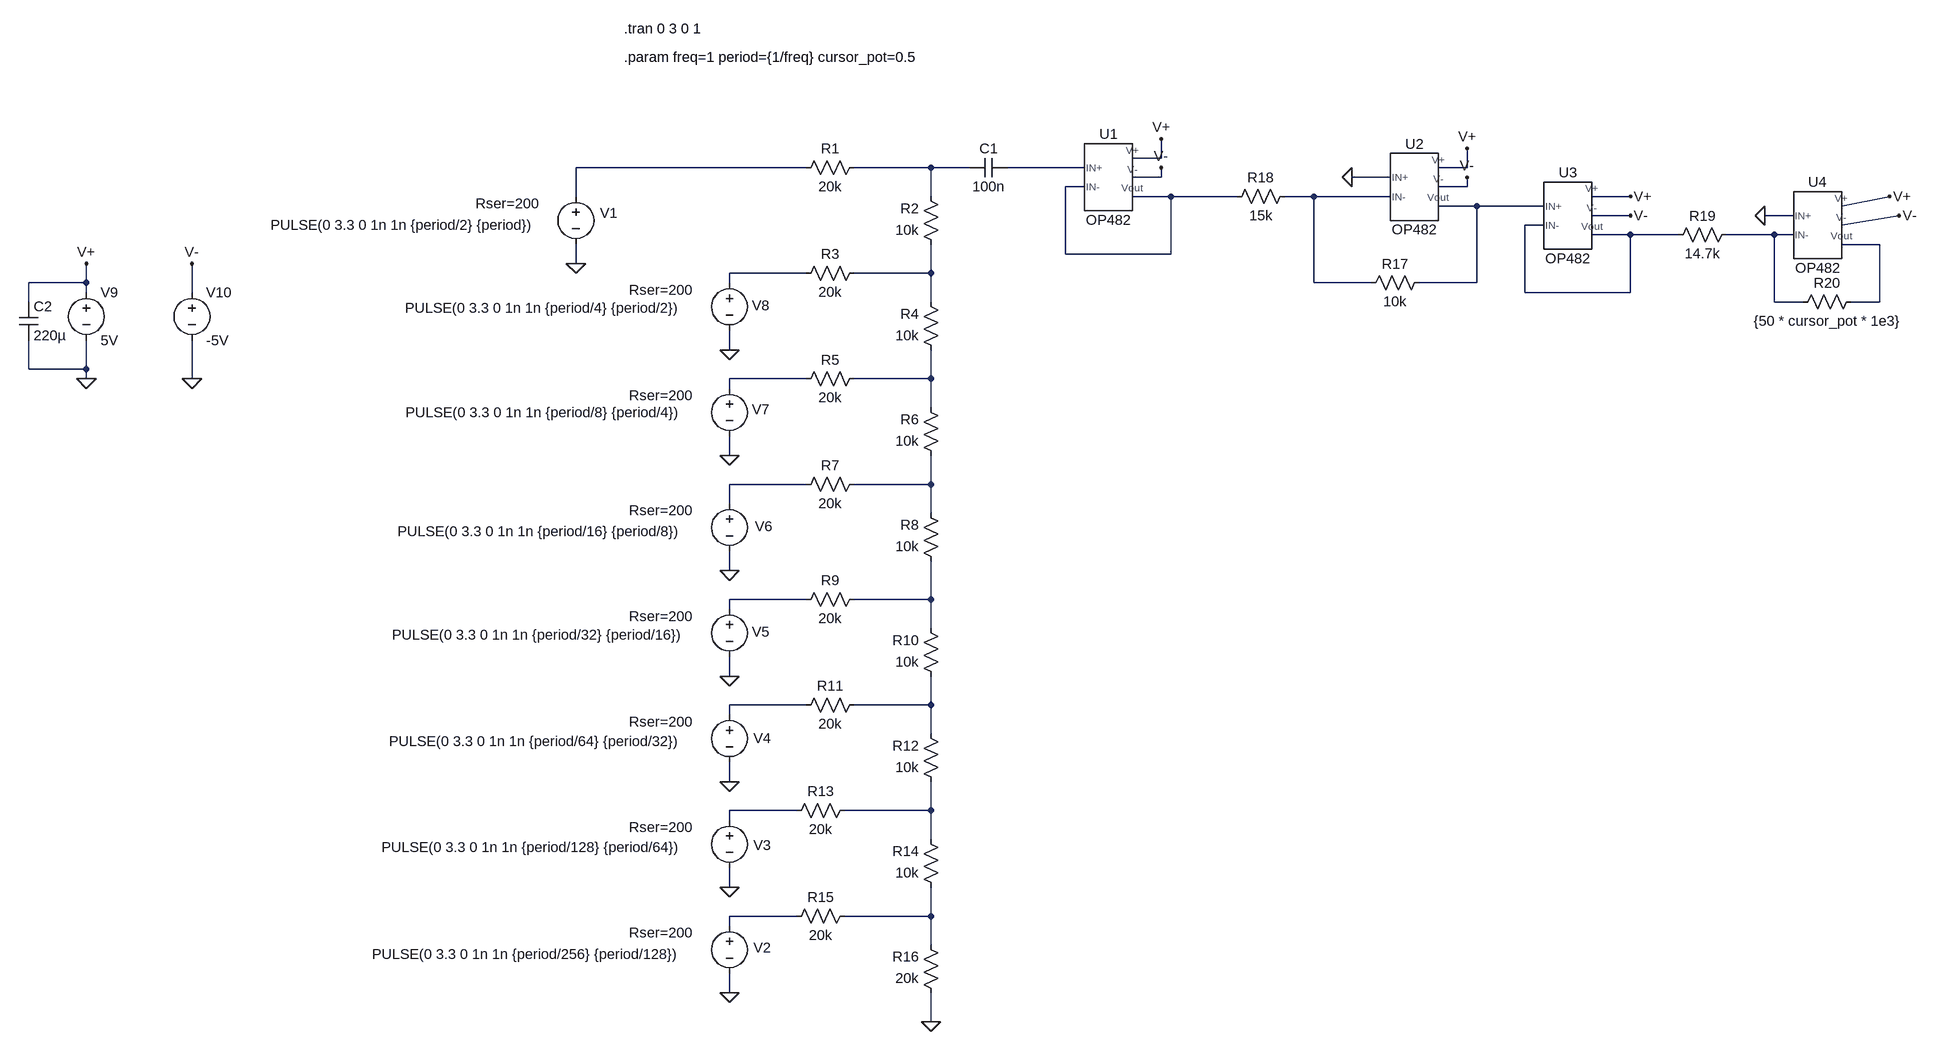
[diagram p0: schematic circuit.asc]
circuit.asc, the LTspice schematic file:
Version 4
SHEET 1 2228 1512
WIRE 752 32 752 0
WIRE 752 32 704 32
WIRE 160 48 -224 48
WIRE 368 48 240 48
WIRE 432 48 368 48
WIRE 624 48 496 48
WIRE 1392 48 1392 16
WIRE 1392 48 1344 48
WIRE 752 64 752 48
WIRE 752 64 704 64
WIRE 1264 64 1200 64
WIRE 624 80 592 80
WIRE 1392 80 1392 64
WIRE 1392 80 1344 80
WIRE -224 96 -224 48
WIRE 368 96 368 48
WIRE 768 96 704 96
WIRE 1008 96 768 96
WIRE 1136 96 1088 96
WIRE 1264 96 1136 96
WIRE 1664 96 1600 96
WIRE 1408 112 1344 112
WIRE 1520 112 1408 112
WIRE 2016 112 2096 96
WIRE 1664 128 1600 128
WIRE 1936 128 1888 128
WIRE 1520 144 1488 144
WIRE 2016 144 2112 128
WIRE 1664 160 1600 160
WIRE 1744 160 1664 160
WIRE 1904 160 1824 160
WIRE 1936 160 1904 160
WIRE 2080 176 2016 176
WIRE 592 192 592 80
WIRE 768 192 768 96
WIRE 768 192 592 192
WIRE -224 208 -224 176
WIRE 160 224 32 224
WIRE 368 224 368 176
WIRE 368 224 240 224
WIRE -1040 240 -1040 208
WIRE -1040 240 -1136 240
WIRE 32 240 32 224
WIRE 1136 240 1136 96
WIRE 1232 240 1136 240
WIRE 1408 240 1408 112
WIRE 1408 240 1312 240
WIRE -1040 256 -1040 240
WIRE -864 256 -864 208
WIRE 1488 256 1488 144
WIRE 1664 256 1664 160
WIRE 1664 256 1488 256
WIRE -1136 272 -1136 240
WIRE 368 272 368 224
WIRE 1904 272 1904 160
WIRE 1952 272 1904 272
WIRE 2080 272 2080 176
WIRE 2080 272 2032 272
WIRE 32 352 32 320
WIRE -1136 384 -1136 336
WIRE -1040 384 -1040 336
WIRE -1040 384 -1136 384
WIRE -1040 400 -1040 384
WIRE -864 400 -864 336
WIRE 160 400 32 400
WIRE 368 400 368 352
WIRE 368 400 240 400
WIRE 32 416 32 400
WIRE 368 448 368 400
WIRE 32 528 32 496
WIRE 160 576 32 576
WIRE 368 576 368 528
WIRE 368 576 240 576
WIRE 32 608 32 576
WIRE 368 624 368 576
WIRE 32 720 32 688
WIRE 160 768 32 768
WIRE 368 768 368 704
WIRE 368 768 240 768
WIRE 32 784 32 768
WIRE 368 816 368 768
WIRE 32 896 32 864
WIRE 160 944 32 944
WIRE 368 944 368 896
WIRE 368 944 240 944
WIRE 32 960 32 944
WIRE 368 992 368 944
WIRE 32 1072 32 1040
WIRE 144 1120 32 1120
WIRE 368 1120 368 1072
WIRE 368 1120 224 1120
WIRE 32 1136 32 1120
WIRE 368 1168 368 1120
WIRE 32 1248 32 1216
WIRE 144 1296 32 1296
WIRE 368 1296 368 1248
WIRE 368 1296 224 1296
WIRE 32 1312 32 1296
WIRE 368 1344 368 1296
WIRE 32 1424 32 1392
WIRE 368 1472 368 1424
FLAG 368 1472 0
FLAG -224 208 0
FLAG 32 1424 0
FLAG 32 1248 0
FLAG 32 1072 0
FLAG 32 896 0
FLAG 32 720 0
FLAG 32 528 0
FLAG 32 352 0
FLAG -1040 400 0
FLAG -864 400 0
FLAG -1040 208 V+
FLAG -864 208 V-
FLAG 1200 64 0
FLAG 1664 96 V+
FLAG 1664 128 V-
FLAG 2096 96 V+
FLAG 2112 128 V-
FLAG 1888 128 0
FLAG 752 0 V+
FLAG 752 48 V-
FLAG 1392 16 V+
FLAG 1392 64 V-
SYMBOL res 256 32 R90
WINDOW 0 0 56 VBottom 2
WINDOW 3 32 56 VTop 2
SYMATTR InstName R1
SYMATTR Value 20k
SYMBOL res 384 192 R180
WINDOW 0 36 76 Left 2
WINDOW 3 36 40 Left 2
SYMATTR InstName R2
SYMATTR Value 10k
SYMBOL res 256 208 R90
WINDOW 0 0 56 VBottom 2
WINDOW 3 32 56 VTop 2
SYMATTR InstName R3
SYMATTR Value 20k
SYMBOL res 384 368 R180
WINDOW 0 36 76 Left 2
WINDOW 3 36 40 Left 2
SYMATTR InstName R4
SYMATTR Value 10k
SYMBOL res 256 384 R90
WINDOW 0 0 56 VBottom 2
WINDOW 3 32 56 VTop 2
SYMATTR InstName R5
SYMATTR Value 20k
SYMBOL res 384 544 R180
WINDOW 0 36 76 Left 2
WINDOW 3 36 40 Left 2
SYMATTR InstName R6
SYMATTR Value 10k
SYMBOL res 256 560 R90
WINDOW 0 0 56 VBottom 2
WINDOW 3 32 56 VTop 2
SYMATTR InstName R7
SYMATTR Value 20k
SYMBOL res 384 720 R180
WINDOW 0 36 76 Left 2
WINDOW 3 36 40 Left 2
SYMATTR InstName R8
SYMATTR Value 10k
SYMBOL res 256 752 R90
WINDOW 0 0 56 VBottom 2
WINDOW 3 32 56 VTop 2
SYMATTR InstName R9
SYMATTR Value 20k
SYMBOL res 384 912 R180
WINDOW 0 36 76 Left 2
WINDOW 3 36 40 Left 2
SYMATTR InstName R10
SYMATTR Value 10k
SYMBOL res 256 928 R90
WINDOW 0 0 56 VBottom 2
WINDOW 3 32 56 VTop 2
SYMATTR InstName R11
SYMATTR Value 20k
SYMBOL res 384 1088 R180
WINDOW 0 36 76 Left 2
WINDOW 3 36 40 Left 2
SYMATTR InstName R12
SYMATTR Value 10k
SYMBOL res 240 1104 R90
WINDOW 0 0 56 VBottom 2
WINDOW 3 32 56 VTop 2
SYMATTR InstName R13
SYMATTR Value 20k
SYMBOL res 384 1264 R180
WINDOW 0 36 76 Left 2
WINDOW 3 36 40 Left 2
SYMATTR InstName R14
SYMATTR Value 10k
SYMBOL res 240 1280 R90
WINDOW 0 0 56 VBottom 2
WINDOW 3 32 56 VTop 2
SYMATTR InstName R15
SYMATTR Value 20k
SYMBOL res 384 1440 R180
WINDOW 0 36 76 Left 2
WINDOW 3 36 40 Left 2
SYMATTR InstName R16
SYMATTR Value 20k
SYMBOL voltage -224 80 R0
WINDOW 3 -509 64 Left 2
WINDOW 123 0 0 Left 0
WINDOW 39 -167 28 Left 2
WINDOW 0 40 44 Left 2
SYMATTR Value PULSE(0 3.3 0 1n 1n {period/2} {period})
SYMATTR SpiceLine Rser=200
SYMATTR InstName V1
SYMBOL voltage 32 1296 R0
WINDOW 3 -596 64 Left 2
WINDOW 123 0 0 Left 0
WINDOW 39 -167 28 Left 2
WINDOW 0 40 53 Left 2
SYMATTR Value PULSE(0 3.3 0 1n 1n {period/256} {period/128})
SYMATTR SpiceLine Rser=200
SYMATTR InstName V2
SYMBOL voltage 32 1120 R0
WINDOW 3 -580 61 Left 2
WINDOW 123 0 0 Left 0
WINDOW 39 -167 28 Left 2
WINDOW 0 40 58 Left 2
SYMATTR Value PULSE(0 3.3 0 1n 1n {period/128} {period/64})
SYMATTR SpiceLine Rser=200
SYMATTR InstName V3
SYMBOL voltage 32 944 R0
WINDOW 3 -567 61 Left 2
WINDOW 123 0 0 Left 0
WINDOW 39 -167 28 Left 2
WINDOW 0 40 56 Left 2
SYMATTR Value PULSE(0 3.3 0 1n 1n {period/64} {period/32})
SYMATTR SpiceLine Rser=200
SYMATTR InstName V4
SYMBOL voltage 32 768 R0
WINDOW 3 -562 59 Left 2
WINDOW 123 0 0 Left 0
WINDOW 39 -167 28 Left 2
WINDOW 0 38 54 Left 2
SYMATTR Value PULSE(0 3.3 0 1n 1n {period/32} {period/16})
SYMATTR SpiceLine Rser=200
SYMATTR InstName V5
SYMBOL voltage 32 592 R0
WINDOW 3 -553 63 Left 2
WINDOW 123 0 0 Left 0
WINDOW 39 -167 28 Left 2
WINDOW 0 43 54 Left 2
SYMATTR Value PULSE(0 3.3 0 1n 1n {period/16} {period/8})
SYMATTR SpiceLine Rser=200
SYMATTR InstName V6
SYMBOL voltage 32 400 R0
WINDOW 3 -540 56 Left 2
WINDOW 123 0 0 Left 0
WINDOW 39 -167 28 Left 2
WINDOW 0 38 51 Left 2
SYMATTR Value PULSE(0 3.3 0 1n 1n {period/8} {period/4})
SYMATTR SpiceLine Rser=200
SYMATTR InstName V7
SYMBOL voltage 32 224 R0
WINDOW 3 -541 58 Left 2
WINDOW 123 0 0 Left 0
WINDOW 39 -167 28 Left 2
WINDOW 0 38 54 Left 2
SYMATTR Value PULSE(0 3.3 0 1n 1n {period/4} {period/2})
SYMATTR SpiceLine Rser=200
SYMATTR InstName V8
SYMBOL OP482 656 64 R0
SYMATTR InstName U1
SYMBOL voltage -1040 240 R0
SYMATTR InstName V9
SYMATTR Value 5V
SYMBOL voltage -864 240 R0
SYMATTR InstName V10
SYMATTR Value -5V
SYMBOL OP482 1296 80 R0
SYMATTR InstName U2
SYMBOL res 1328 224 R90
WINDOW 0 0 56 VBottom 2
WINDOW 3 32 56 VTop 2
SYMATTR InstName R17
SYMATTR Value 10k
SYMBOL res 1104 80 R90
WINDOW 0 0 56 VBottom 2
WINDOW 3 32 56 VTop 2
SYMATTR InstName R18
SYMATTR Value 15k
SYMBOL OP482 1552 128 R0
SYMATTR InstName U3
SYMBOL OP482 1968 144 R0
SYMATTR InstName U4
SYMBOL res 1840 144 R90
WINDOW 0 0 56 VBottom 2
WINDOW 3 32 56 VTop 2
SYMATTR InstName R19
SYMATTR Value 14.7k
SYMBOL res 2048 256 R90
WINDOW 0 0 56 VBottom 2
WINDOW 3 32 56 VTop 2
SYMATTR InstName R20
SYMATTR Value {50 * cursor_pot * 1e3}
SYMBOL cap -1152 272 R0
SYMATTR InstName C2
SYMATTR Value 220µ
SYMBOL cap 496 32 R90
WINDOW 0 0 32 VBottom 2
WINDOW 3 32 32 VTop 2
SYMATTR InstName C1
SYMATTR Value 100n
TEXT -144 -136 Left 2 !.param freq=1 period={1/freq} cursor_pot=0.5
TEXT -144 -184 Left 2 !.tran 0 3 0 1

The netlist it stands for:
* circuit.asc
R1 N002 N001 20k
R2 N011 N002 10k
R3 N011 N010 20k
R4 N013 N011 10k
R5 N013 N012 20k
R6 N015 N013 10k
R7 N015 N014 20k
R8 N017 N015 10k
R9 N017 N016 20k
R10 N019 N017 10k
R11 N019 N018 20k
R12 N021 N019 10k
R13 N021 N020 20k
R14 N023 N021 10k
R15 N023 N022 20k
R16 0 N023 20k
V1 N001 0 PULSE(0 3.3 0 1n 1n {period/2} {period}) Rser=200
V2 N022 0 PULSE(0 3.3 0 1n 1n {period/256} {period/128}) Rser=200
V3 N020 0 PULSE(0 3.3 0 1n 1n {period/128} {period/64}) Rser=200
V4 N018 0 PULSE(0 3.3 0 1n 1n {period/64} {period/32}) Rser=200
V5 N016 0 PULSE(0 3.3 0 1n 1n {period/32} {period/16}) Rser=200
V6 N014 0 PULSE(0 3.3 0 1n 1n {period/16} {period/8}) Rser=200
V7 N012 0 PULSE(0 3.3 0 1n 1n {period/8} {period/4}) Rser=200
V8 N010 0 PULSE(0 3.3 0 1n 1n {period/4} {period/2}) Rser=200
XU1 N003 N004 V+ V- N004 OP482  ; pins IN+ IN- V+ V- Vout
V9 V+ 0 5V
V10 V- 0 -5V
XU2 0 N005 V+ V- N006 OP482  ; pins IN+ IN- V+ V- Vout
R17 N006 N005 10k
R18 N005 N004 15k
XU3 N006 N007 V+ V- N007 OP482  ; pins IN+ IN- V+ V- Vout
XU4 0 N008 V+ V- N009 OP482  ; pins IN+ IN- V+ V- Vout
R19 N008 N007 14.7k
R20 N009 N008 {50 * cursor_pot * 1e3}
C2 V+ 0 220µ
C1 N003 N002 100n
.param freq=1 period={1/freq} cursor_pot=0.5
.tran 0 3 0 1
.lib C:\Users\bstanea\OneDrive - NI\Desktop\WF_Test_Utilities\ADC_R2R_ladder\_SIMULATION\op482.cir
.backanno
.end